# Altium schematic sheet STM32.SchDoc
size A; SheetNumber: 2; SheetTotal: 4
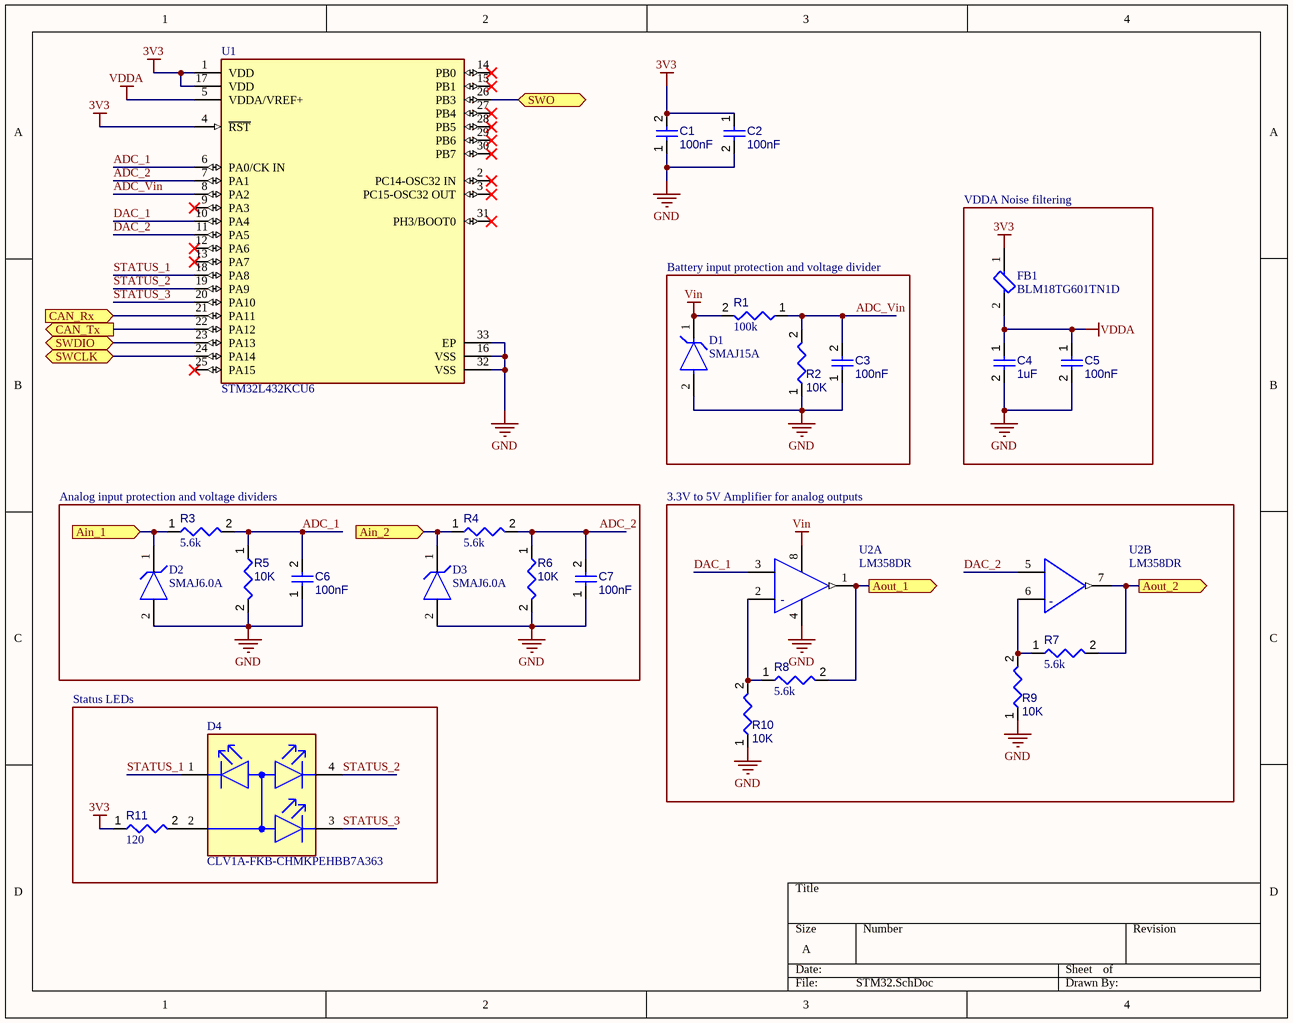
[diagram p0: STM32.SchDoc]

## Parts
C1  100nF  [CAPC0402(1005)60_L]
C2  100nF  [CAPC0402(1005)60_L]
C3  100nF  [CAPC0402(1005)60_L]
C4  1uF  [CAPC0402(1005)60_L]
C5  100nF  [CAPC0402(1005)60_L]
C6  100nF  [CAPC0402(1005)60_L]
C7  100nF  [CAPC0402(1005)60_L]
D1  SMAJ15A  [FP-SMA-MFG]
D2  SMAJ6.0A  [FP-SMA-MFG]
D3  SMAJ6.0A  [FP-SMA-MFG]
D4  CLV1A-FKB-CHMKPEHBB7A363  [FP-CLV1A-FKB-CHMKPEHBB7A3-MFG]
FB1  BLM18TG601TN1D  [FP-BLM18-0_15-0_1-t0_6-MFG]
R1  value 100k  [RESC0402(1005)_L]  (hidden comment: Resistor 100K +/-1 % 0402 63 mW)
R2  10K  [RESC0402(1005)_L]
R3  value 5.6k  [RESC0402(1005)_L]  (hidden comment: Resistor 5K6  +/-5 % 0402 63 mW)
R4  value 5.6k  [RESC0402(1005)_L]  (hidden comment: Resistor 5K6  +/-5 % 0402 63 mW)
R5  10K  [RESC0402(1005)_L]
R6  10K  [RESC0402(1005)_L]
R7  value 5.6k  [RESC0402(1005)_L]  (hidden comment: Resistor 5K6  +/-5 % 0402 63 mW)
R8  value 5.6k  [RESC0402(1005)_L]  (hidden comment: Resistor 5K6  +/-5 % 0402 63 mW)
R9  10K  [RESC0402(1005)_L]
R10  10K  [RESC0402(1005)_L]
R11  value 120  [RESC0603(1608)_L]  (hidden comment: Resistor 120R +/-5 % 0603 0.1 W)
U1  STM32L432KCU6  [FP-UFQFPN32-A0B8-MFG]
U2  LM358DR  [FP-D0008A-MFG]  (parts A,B of 2)

## Blocks framed on the sheet
VDDA Noise filtering: C4 C5 FB1
Battery input protection and voltage divider: C3 D1 R1 R2
Analog input protection and voltage dividers: C6 C7 D2 D3 R3-R6
3.3V to 5V Amplifier for analog outputs: R7-R10 U2
Status LEDs: D4 R11

## Ports
Ain_1 (in), Ain_2 (in), Aout_1 (out), Aout_2 (out), CAN_Rx (in), CAN_Tx (out), SWCLK (bidir), SWDIO (bidir), SWO (bidir)

## Nets
3V3: C1.2 C2.1 FB1.1 R11.1 U1.1(VDD) U1.4(~{RST}) U1.17(VDD)
GND: C1.1 C2.2 C3.1 C4.2 C5.2 C6.1 C7.1 D1.2(A) D2.2(A) D3.2(A) R2.1 R5.2 R6.2 R9.1 R10.1 U1.16(VSS) U1.32(VSS) U1.33(EP) U2.4(V-)
VDDA: C4.1 C5.1 FB1.2 U1.5(VDDA/VREF+)
Vin: D1.1(C) R1.2 U2.8(V+)
ADC_1: C6.2 R3.2 R5.1 U1.6(PA0/CK_IN)
ADC_2: C7.2 R4.2 R6.1 U1.7(PA1)
ADC_Vin: C3.2 R1.1 R2.2 U1.8(PA2)
Ain_1: D2.1(C) R3.1 ; port Ain_1
Ain_2: D3.1(C) R4.1 ; port Ain_2
Aout_1: R8.2 U2.1(1OUT) ; port Aout_1
Aout_2: R7.2 U2.7(2OUT) ; port Aout_2
CAN_Rx: U1.21(PA11) ; port CAN_Rx
CAN_Tx: U1.22(PA12) ; port CAN_Tx
DAC_1: U1.10(PA4) U2.3(IN1+)
DAC_2: U1.11(PA5) U2.5(IN2+)
STATUS_1: D4.1(RED(C)) U1.18(PA8)
STATUS_2: D4.4(GREEN(C)) U1.19(PA9)
STATUS_3: D4.3(BLUE(C)) U1.20(PA10)
SWCLK: U1.24(PA14) ; port SWCLK
SWDIO: U1.23(PA13) ; port SWDIO
SWO: U1.26(PB3) ; port SWO
NetD4_2: D4.2(COMMON_ANODE) R11.2
NetR7_1: R7.1 R9.2 U2.6(IN2-)
NetR8_1: R8.1 R10.2 U2.2(IN1-)

Not connected (* = marked no-connect by the designer): U1 2(PC14-OSC32_IN)* 3(PC15-OSC32_OUT)* 9(PA3)* 12(PA6)* 13(PA7)* 14(PB0)* 15(PB1)* 25(PA15)* 27(PB4)* 28(PB5)* 29(PB6)* 30(PB7)* 31(PH3/BOOT0)*

## Notes on the sheet
- (in symbol CMP-1685-00009-2, part A) -
- (in symbol CMP-1685-00009-2, part B) -

## Library data of the parts
C1-C3 C5-C7 = CMP-001-00061-2: Chip Capacitor, 100nF +/-20%, 10V, 0402, Thickness 0.6 mm; Tolerance: 20%; Max Operating Temperature: 85°C; Min Operating Temperature: -55°C; Voltage Rating: 10V; Case/Package: 0402; Mounting Technology: SMT; Pins: 2; Value: 100nF
C4 = CMP-001-00063-2: Chip Capacitor, 1µF +/-20%, 10V, 0402, Thickness 0.6 mm; Tolerance: 10%; Max Operating Temperature: 85°C; Case/Package: 0402; Voltage Rating: 10V; Min Operating Temperature: -55°C; Mounting Technology: SMT; Pins: 2; Value: 1µF
D1 = CMP-07401-000026-1: TVS DIODE 15V 24.4V SMA; Manufacturer: Bourns Inc.; Max Junction Temp: +150°C; Peak Pulse Current: 16.4A; Direction: Unidirectional; Breakdown Voltage: 16.7V; Number Of Channels: 1; Peak Pulse Power: 400W; Mouser Description: Bourns Smaj15a / Diode Tvs 15v 400w Uni 5% Smd Bourns; Temperature Range Low: -55°C; ComponentLink2Description: Datasheet; Package: SMA; Reverse Standoff Voltage: 15V; Category: Diode; Device Class L2: TVS Diodes; Lead Free: Yes; RoHS: TRUE; Clamping Voltage: 24.4V; ComponentLink2URL: https://www.bourns.com/docs/Product-Datasheets/SMAJ.pdf; Digikey Description: TVS DIODE 15V 24.4V SMA; Temperature Range High: +150°C; Height: 2.29mm; Device Class L1: Circuit Protection; Device Class L3: unset; Temperature: -55°C to +150°C; Octopart: https://octopart.com/smaj15a-bourns-12809353; Manufacturer Part Number: SMAJ15A; Automotive: No
D2 D3 = CMP-07401-000002-1: TVS DIODE 6V 10.3V SMA; Manufacturer: Bourns Inc.; Max Junction Temp: +150°C; Peak Pulse Power: 400W; Breakdown Voltage: 6.67V; Peak Pulse Current: 38.8A; Direction: Unidirectional; Number Of Channels: 1; Clamping Voltage: 10.3V; Digikey Description: TVS DIODE 6V 10.3V SMA; Automotive: No; Octopart: https://octopart.com/smaj6.0a-bourns-12809397; Package: SMA; Temperature Range High: +150°C; Manufacturer Part Number: SMAJ6.0A; Device Class L2: TVS Diodes; Temperature Range Low: -55°C; ComponentLink2URL: https://www.bourns.com/docs/product-datasheets/smaj.pdf?sfvrsn=d2266a96_11; Lead Free: Yes; Device Class L1: Circuit Protection; Mouser Description: Diode TVS Single Uni-Dir 6V 400W 2-Pin SMA T/R; RoHS: TRUE; Height: 2.29mm; Category: Diode; Temperature: -55°C to +150°C; Reverse Standoff Voltage: 6V; ComponentLink2Description: Datasheet; Device Class L3: unset
D4 = CMP-13977-000017-1: LED RGB 4PLCC SMD; Lens Color: White; Number of Elements: 3; Dominant Wavelength: 470nm; Forward Voltage: 3.2V; Luminous Intensity: 315mcd; Lens Style: Round; Viewing Angle: 120°; Number of LEDs: 1; Test Current: 20mA; Lens Transparency: Diffused; Reverse Voltage: 5V; Color: Blue; Height: 2.1mm; Package Quantity: 2000; Length: 2.8mm; Number of Pins: 4; Packaging: Tape and Reel; Width: 2.8mm; Radiation Hardening: No; Depth: 3.2mm; Mount: Surface Mount; Min Operating Temperature: -40°C; Forward Current: 20mA; Max Operating Temperature: 100°C; Case/Package: PLCC
FB1 = CMP-0686-00527-3: FERRITE BEAD 600 OHM 0603 1LN; Current Rating: 200mA; Test Frequency: 100MHz; Tolerance: 25%; Impedance: 600R; DC Resistance (DCR): 450mR; Number of Lines: 1; Material: Steel; Number of Pins: 2; Height: 0.8mm; Max Operating Temperature: 125°C; Case Code (Imperial): 0603; Case/Package: 0603; REACH SVHC: No SVHC; Max Current Rating: 200mA; Width: 0.8mm; Package Quantity: 10000; Depth: 0.8mm; Length: 1.6mm; Lead Free: Lead Free; Max DC Current: 200mA; Min Operating Temperature: -55°C; Number of Circuits: 1; Termination: SMD/SMT; Case Code (Metric): 1608; Packaging: Tape and Reel
R1 = CMP-009-00168-2: Chip Resistor, 100 kOhms, +/-1 %, 63 mW, -55 to 155 degC, 0402; Power: 63mW; Tolerance: 1%; Pins: 2; Min Operating Temperature: -55°C; Max Operating Temperature: 155°C; Case/Package: 0402
R2 R5 R6 R9 R10 = CMP-009-00149-2: Chip Resistor, 10 kOhms, +/-1 %, 63 mW, -55 to 125 degC, 0402; Power: 63mW; Tolerance: 1%; Max Operating Temperature: 155°C; Min Operating Temperature: -55°C; Case/Package: 0402; Pins: 2; Value: 10k
R3 R4 R7 R8 = CMP-009-00136-2: Chip Resistor, 5,6 kOhms, +/-5 %, 63 mW, -55 to 155 degC, 0402; Tolerance: 5%; Power: 63mW; Pins: 2; Case/Package: 0402; Min Operating Temperature: -55°C; Max Operating Temperature: 155°C
R11 = CMP-009-00176-2: Chip Resistor, 120 Ohms, +/-5 %, 0.1 W, -55 to 155 degC, 0603; Power: 100mW; Tolerance: 5%; Case/Package: 0603; Max Operating Temperature: 155°C; Pins: 2; Min Operating Temperature: -55°C
U1 = CMP-12105-000033-1: IC MCU 32BIT 256KB FLASH 32QFPN; Manufacturer: STMicroelectronics; Max Supply Voltage: 3.6V; Number Of Timers/Counters: 11; Ram Size: 64KBytes; Number Of Usb Channels: 1; Memory Size: 256KBytes; Number Of Uart Channels: 3; Frequency: 80MHz; Number Of I2C Channels: 2; Core Architecture: ARM Cortex-M4; Number Of I/Os: 26; Min Supply Voltage: 1.62V; Data Bus Width: 32bits; Max Junction Temp: +105°C; Interface: I2C,SPI,UART,USART,CAN,USB,LIN,IrDA,Other; Ambient Temperature Range High: +85°C; Category: IC; Device Class L2: Embedded Processors and Controllers; Ambient Temperature Range Low: -40°C; Number Of Adc Channels: 11; ComponentLink2Description: Datasheet; Number Of A/D Converters: 1; Device Class L1: Integrated Circuits (ICs); Memory Type: FLASH; Height: 0.6mm; Temperature: -40°C to +105°C; Automotive: No; Temperature Range Low: -40°C; Digikey Description: IC MCU 32BIT 256KB FLASH 32QFPN; Manufacturer Part Number: STM32L432KCU6; Temperature Range High: +105°C; Octopart: https://octopart.com/stm32l432kcu6-stmicroelectronics-71093510; Device Class L3: Microcontrollers; Number Of Pwm Channels: 1; Number Of Spi Channels: 2; Lead Free: Yes; Number Of Cores: 1; Package: UFQFPN32-A0B8; ComponentLink2URL: https://www.st.com/content/ccc/resource/technical/document/datasheet/24/01/9f/59/f0/83/47/fc/DM00257205.pdf/files/DM00257205.pdf/jcr:content/translations/en.DM00257205.pdf; RoHS: TRUE
U2 = CMP-1685-00009-2: IC OPAMP GP 2 CIRCUIT 8SOIC; Output Current: 30mA; Min Dual Supply Voltage: 1.5V; Input Offset Voltage (Vos): 7mV; Power Supply Rejection Ratio (PSRR): 65dB; Unity Gain Bandwidth Product: 700kHz; Number of Channels: 2; Min Supply Voltage: 3V; Max Dual Supply Voltage: 16V; Dual Supply Voltage: 9V; Max Supply Voltage: 32V; Nominal Supply Current: 1.2mA; Slew Rate: 0.3V/µs; Input Bias Current: 250nA; Voltage Gain: 100dB; Operating Supply Current: 1mA; REACH SVHC: No SVHC; Package Quantity: 2500; Width: 3.91mm; Max Operating Temperature: 70°C; Min Operating Temperature: 0°C; Mount: Surface Mount; Length: 4.9mm; Radiation Hardening: No; Case/Package: SOIC; Lead Free: Lead Free; Number of Elements: 2; Packaging: Tape and Reel; Output Current per Channel: 30mA; Number of Circuits: 2; Bandwidth: 700kHz; Operating Supply Voltage: 16V; Gain Bandwidth Product: 700kHz; Number of Pins: 8; Number of Amplifiers: 2; Height: 1.58mm; Common Mode Rejection Ratio: 65dB; Contact Plating: Gold